# EAGLE schematic Drawing_binary_decimal_converter (EAGLE 9.5.2)
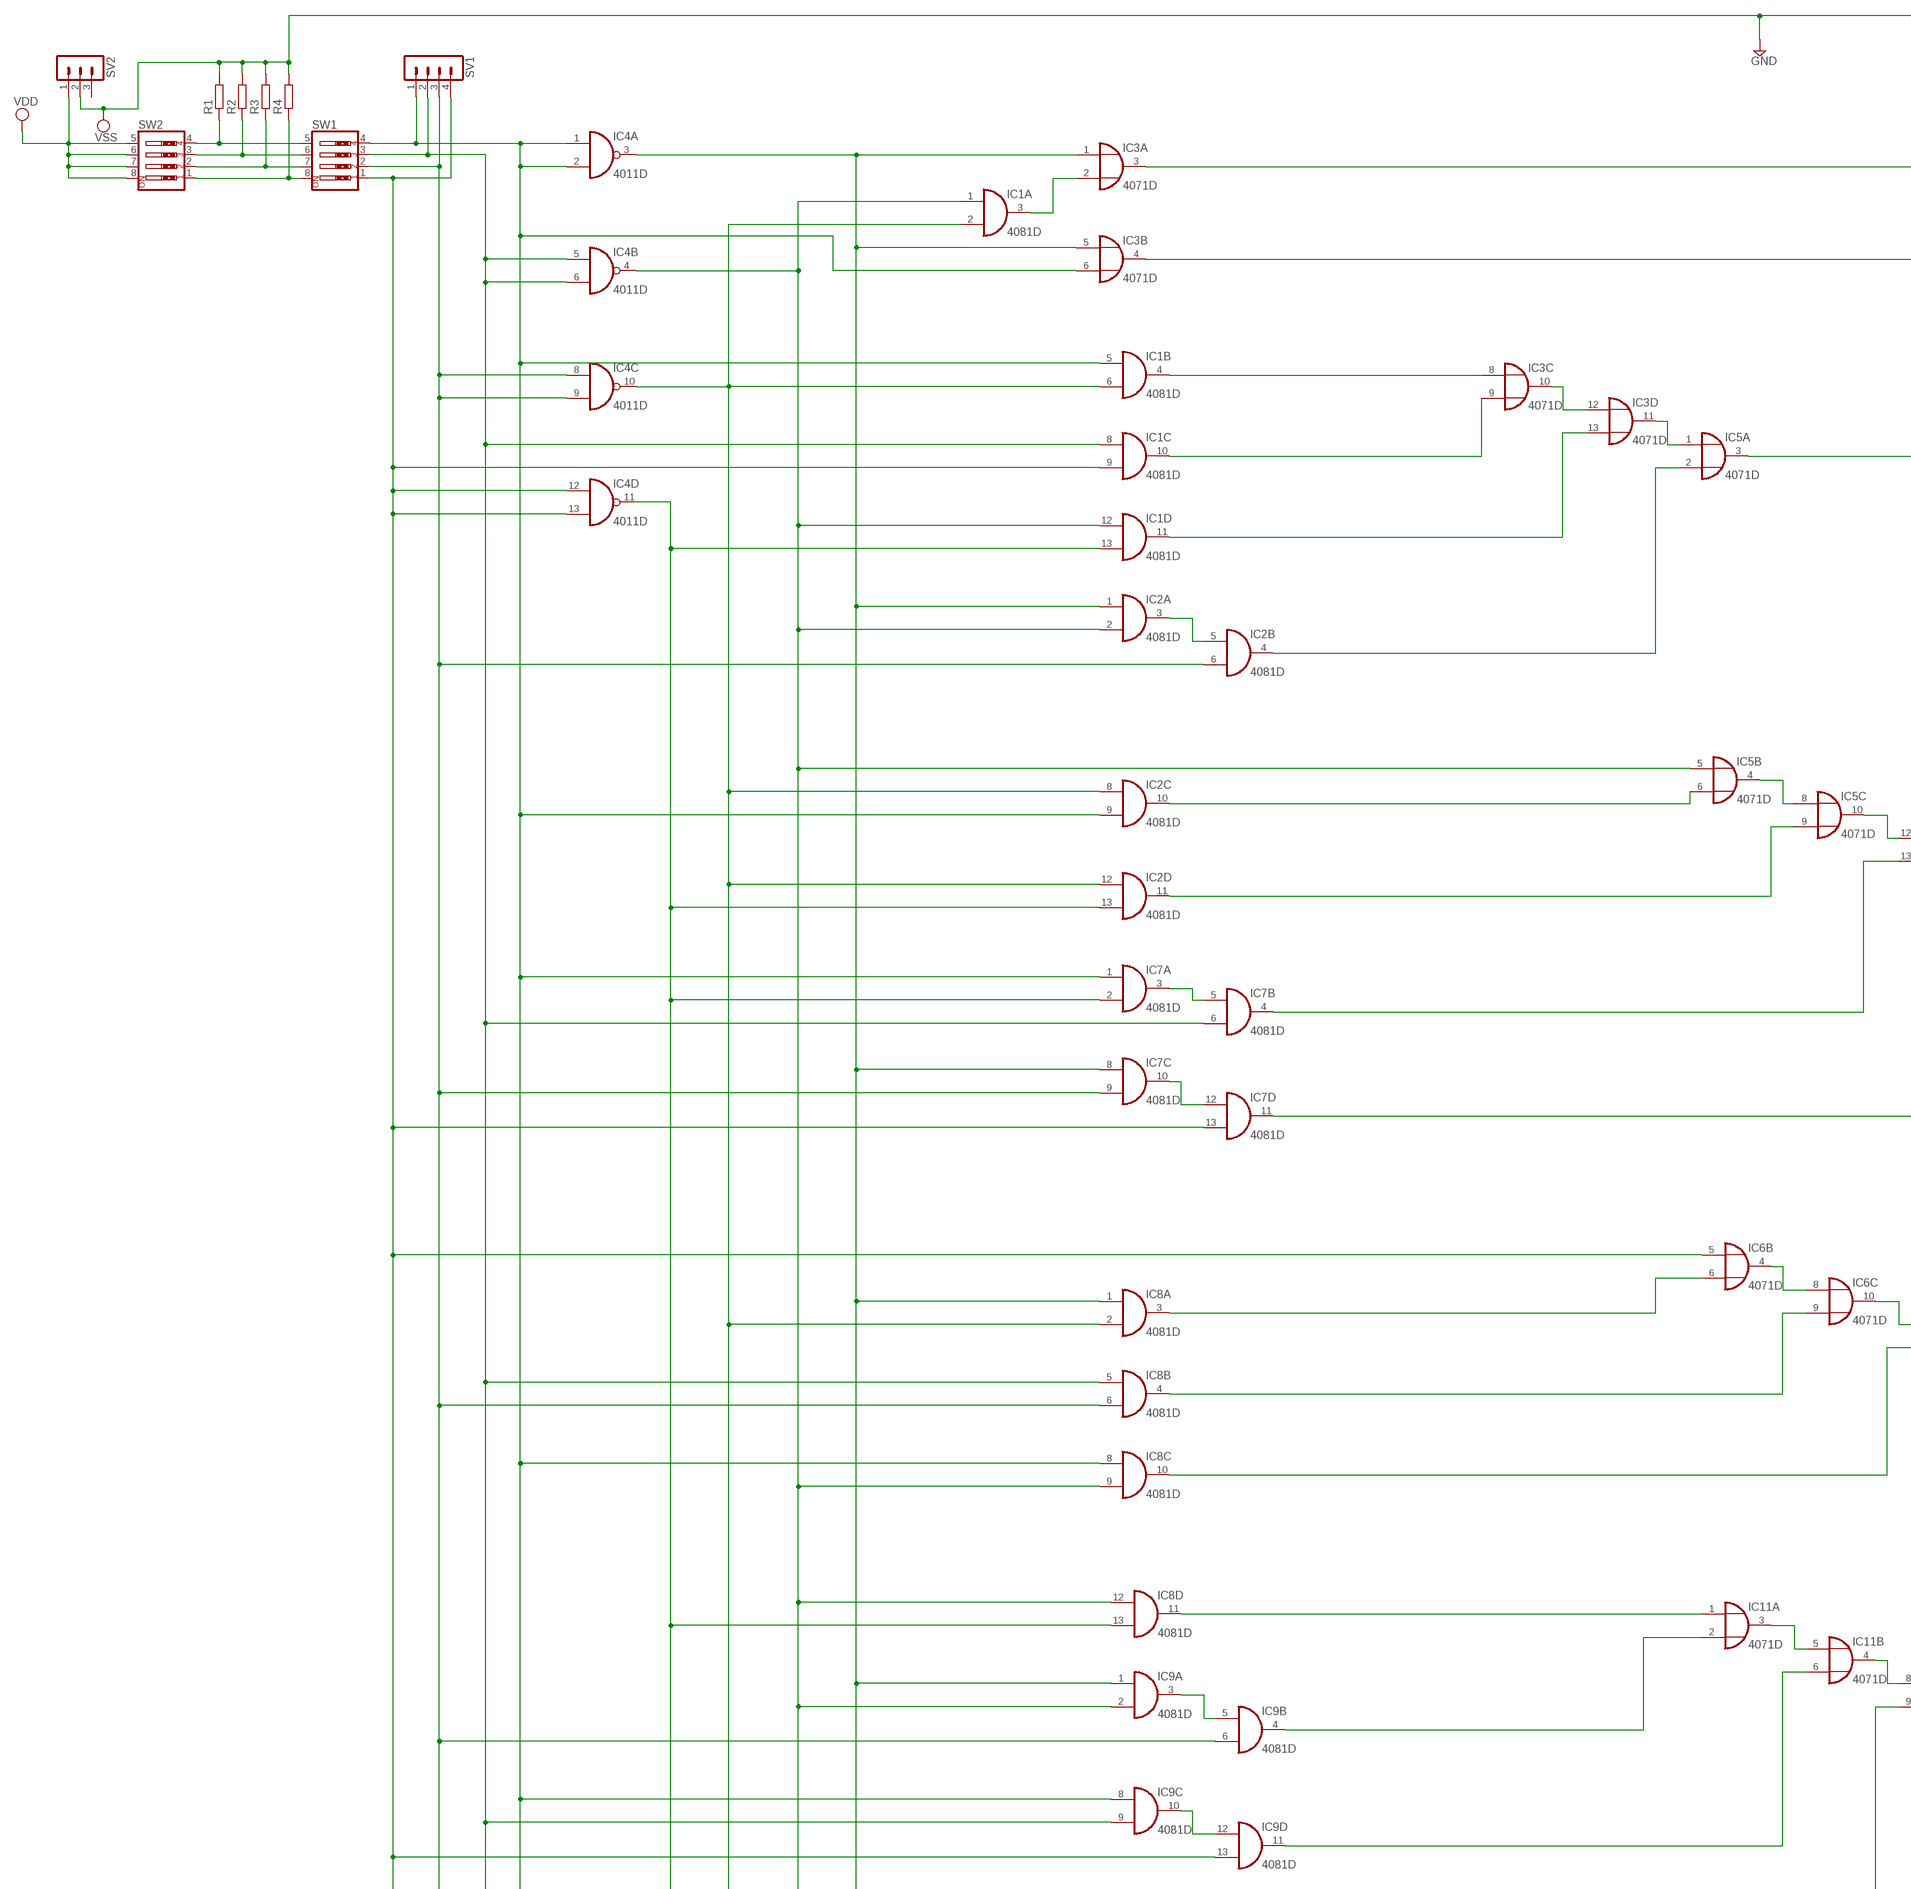
[diagram p0: schematic, sheet 1, part 1 of 3]
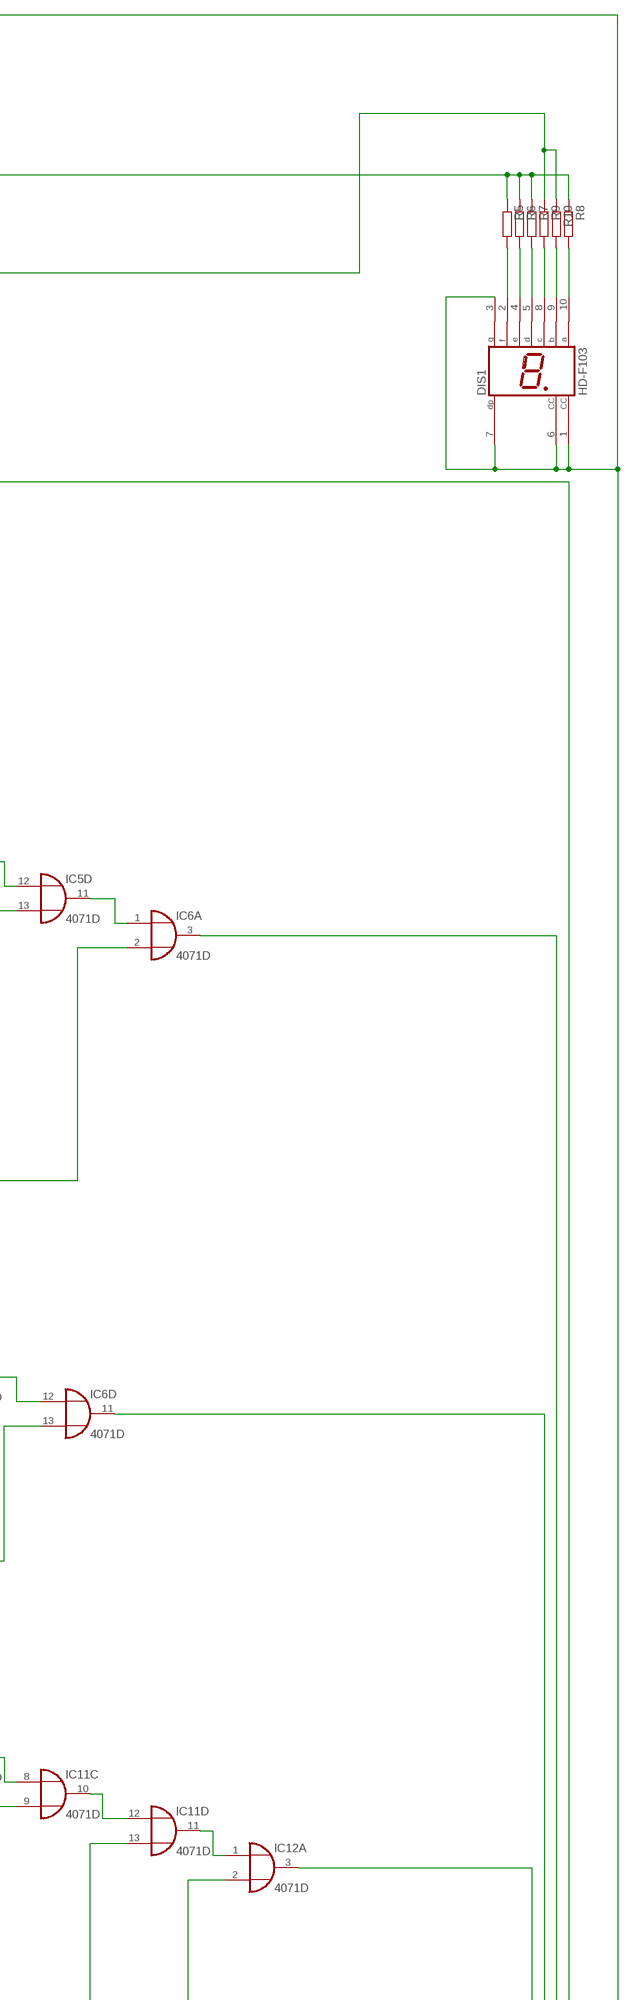
[diagram p1: schematic, sheet 1, part 2 of 3]
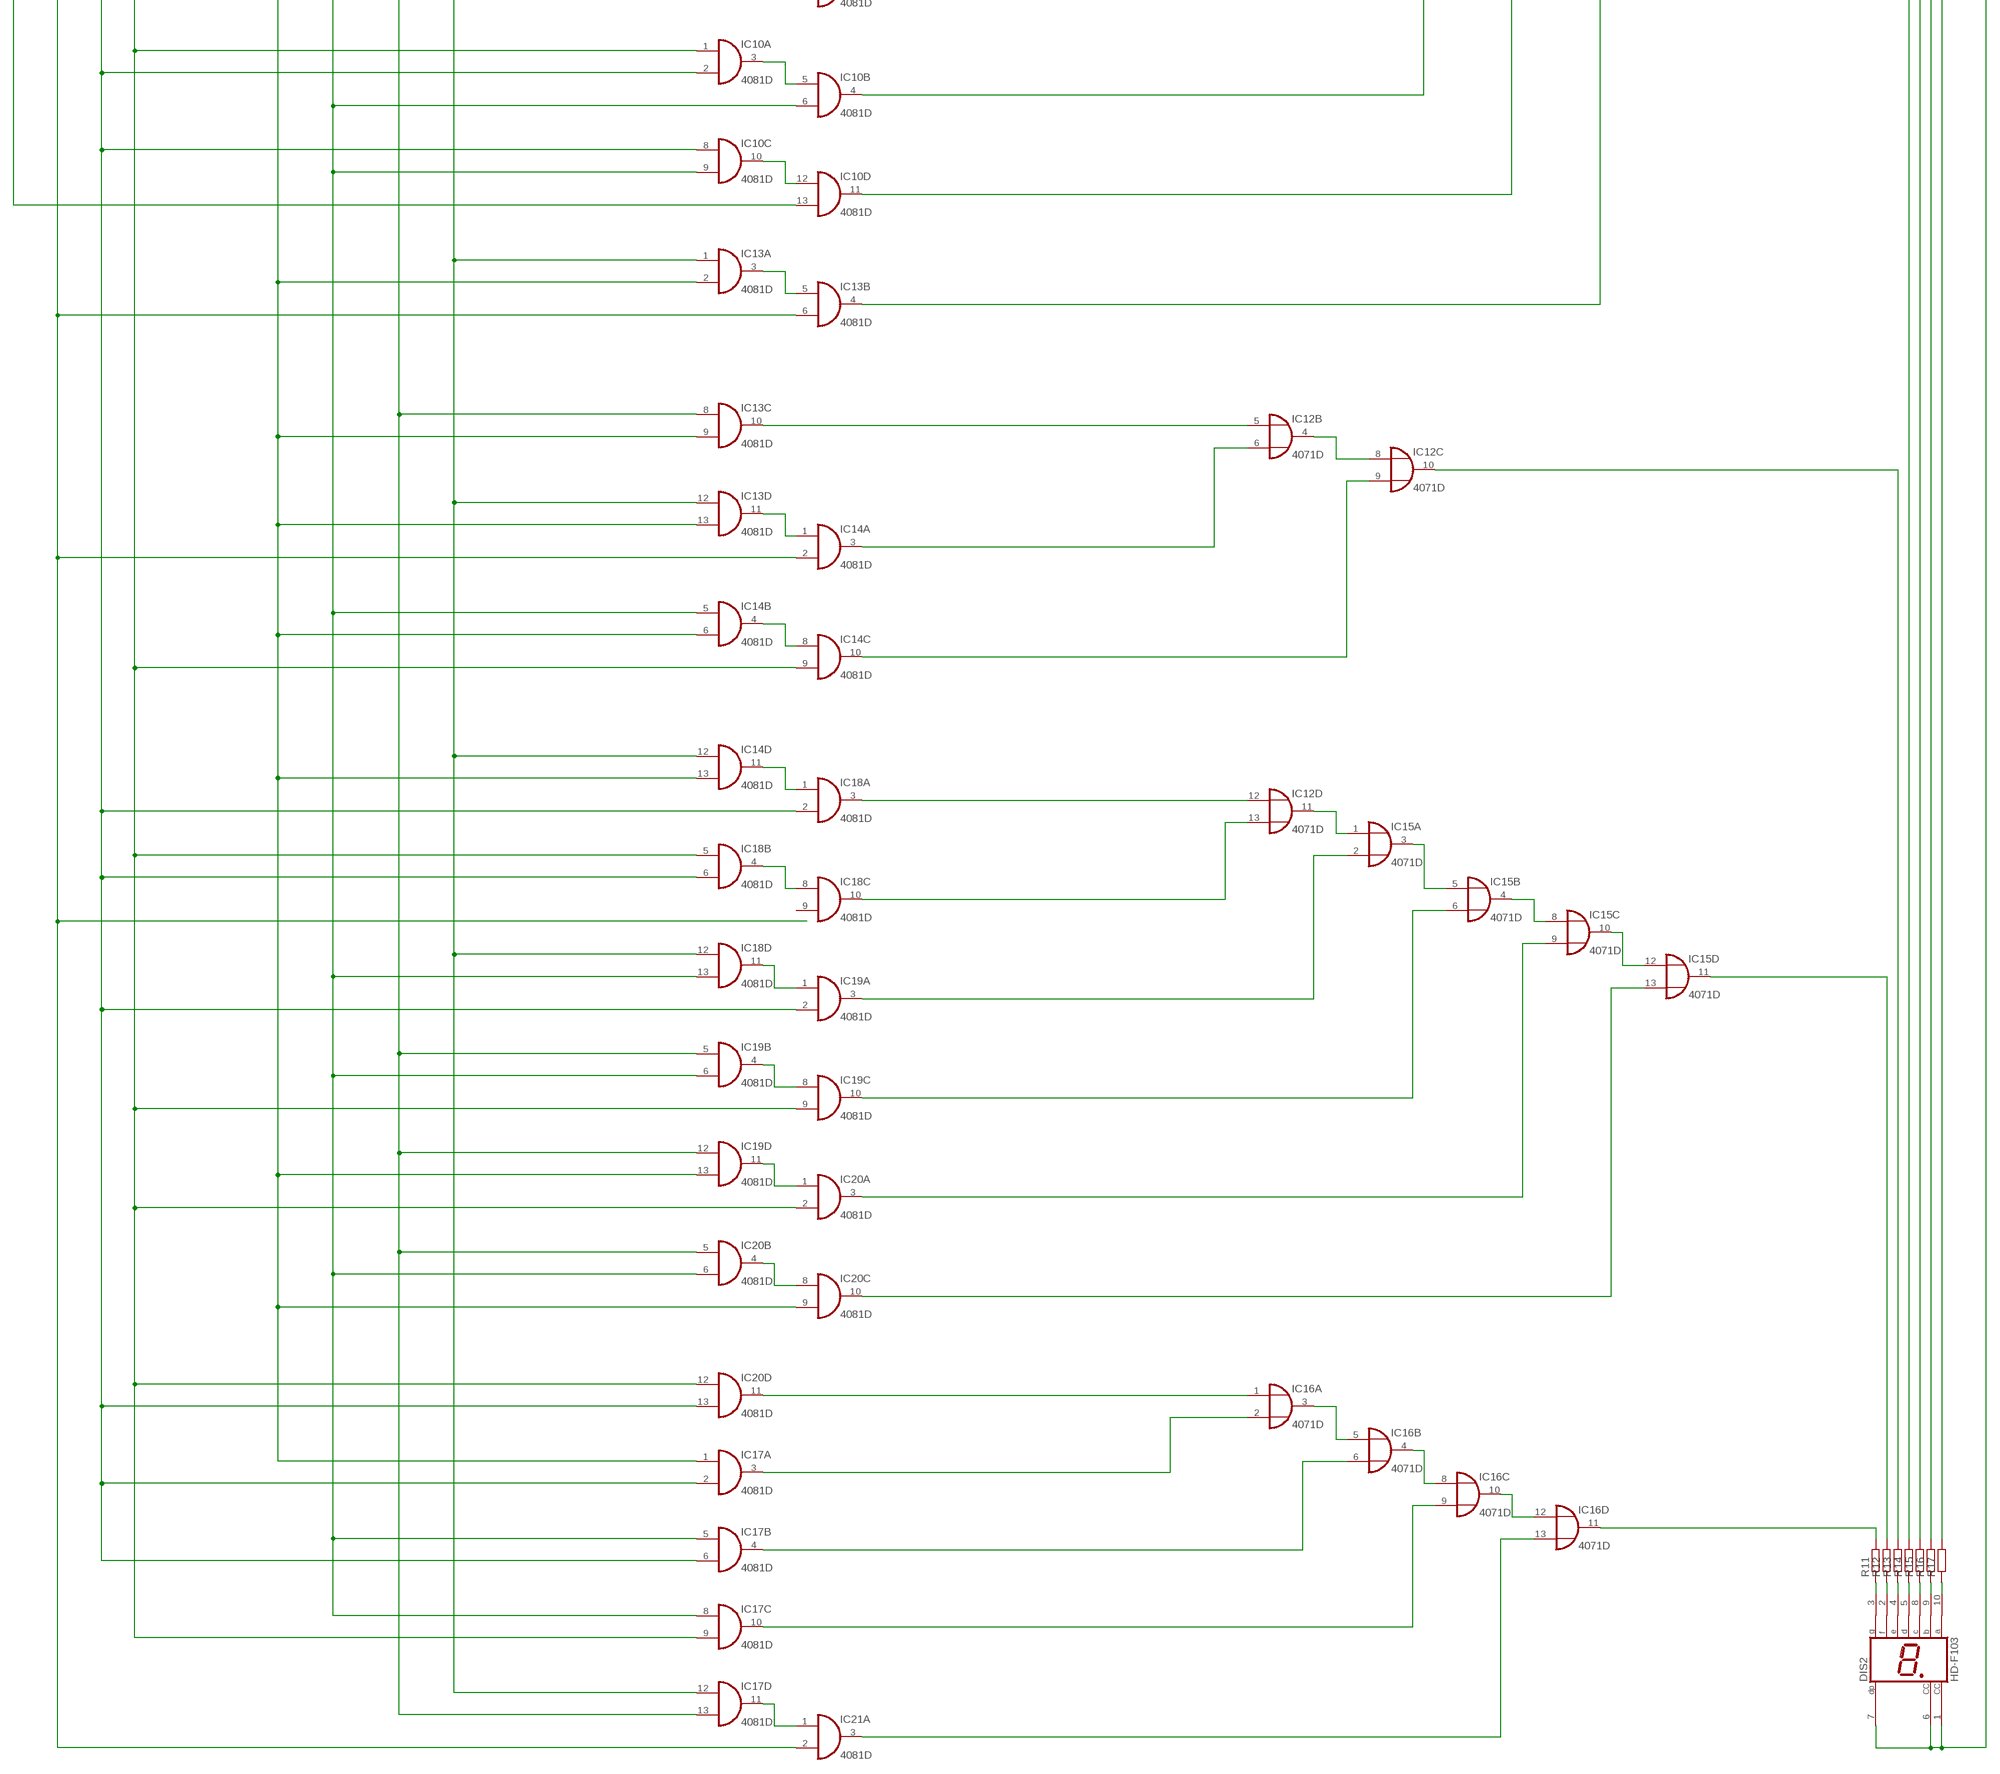
[diagram p2: schematic, sheet 1, part 3 of 3]

## Parts
DIS1  HD-F103  [HDSP-E]
DIS2  HD-F103  [HDSP-E]
IC1  4081D  [SO14]
IC2  4081D  [SO14]
IC3  4071D  [SO14]
IC4  4011D  [SO14]
IC5  4071D  [SO14]
IC6  4071D  [SO14]
IC7  4081D  [SO14]
IC8  4081D  [SO14]
IC9  4081D  [SO14]
IC10  4081D  [SO14]
IC11  4071D  [SO14]
IC12  4071D  [SO14]
IC13  4081D  [SO14]
IC14  4081D  [SO14]
IC15  4071D  [SO14]
IC16  4071D  [SO14]
IC17  4081D  [SO14]
IC18  4081D  [SO14]
IC19  4081D  [SO14]
IC20  4081D  [SO14]
IC21  4081D  [SO14]
R1  R-EU_R1206  [R1206]
R2  R-EU_R1206  [R1206]
R3  R-EU_R1206  [R1206]
R4  R-EU_R1206  [R1206]
R5  R-EU_R1206  [R1206]
R6  R-EU_R1206  [R1206]
R7  R-EU_R1206  [R1206]
R8  R-EU_R1206  [R1206]
R9  R-EU_R1206  [R1206]
R10  R-EU_R1206  [R1206]
R11  R-EU_R1206  [R1206]
R12  R-EU_R1206  [R1206]
R13  R-EU_R1206  [R1206]
R14  R-EU_R1206  [R1206]
R15  R-EU_R1206  [R1206]
R16  R-EU_R1206  [R1206]
R17  R-EU_R1206  [R1206]
SV1  MA04-1  [MA04-1]
SV2  MA03-1  [MA03-1]
SW1  SW_DIP-4  [EDG-04]
SW2  SW_DIP-4  [EDG-04]

## Nets
N$1: IC1.3(A:O) IC3.2(A:I1)
N$2: IC1.2(A:I1) IC1.6(B:I1) IC2.8(C:I0) IC2.12(D:I0) IC4.10(C:O) IC8.2(A:I1) IC10.6(B:I1) IC10.9(C:I1) IC14.5(B:I0) IC17.5(B:I0) IC17.8(C:I0) IC18.13(D:I1) IC19.6(B:I1) IC20.6(B:I1)
N$3: IC6.4(B:O) IC6.8(C:I0)
N$4: IC1.8(C:I0) IC4.5(B:I0) IC4.6(B:I1) IC7.6(B:I1) IC8.5(B:I0) IC9.9(C:I1) IC10.2(A:I1) IC10.8(C:I0) IC17.2(A:I1) IC17.6(B:I1) IC18.2(A:I1) IC18.6(B:I1) IC19.2(A:I1) IC20.13(D:I1) SV1.2 SW1.3
N$5: IC1.1(A:I0) IC1.12(D:I0) IC2.2(A:I1) IC4.4(B:O) IC5.5(B:I0) IC8.9(C:I1) IC8.12(D:I0) IC9.2(A:I1) IC13.8(C:I0) IC17.13(D:I1) IC19.5(B:I0) IC19.12(D:I0) IC20.5(B:I0)
N$6: IC2.6(B:I1) IC4.8(C:I0) IC4.9(C:I1) IC7.9(C:I1) IC8.6(B:I1) IC9.6(B:I1) IC13.6(B:I1) IC14.2(A:I1) IC21.2(A:I1) SV1.3 SW1.2
N$7: R1.1 SW1.5 SW2.4
N$8: IC3.3(A:O) R5.1 R6.1 R7.1 R8.1
N$9: IC2.1(A:I0) IC3.1(A:I0) IC3.5(B:I0) IC4.3(A:O) IC7.8(C:I0) IC8.1(A:I0) IC9.1(A:I0) IC13.1(A:I0) IC13.12(D:I0) IC14.12(D:I0) IC17.12(D:I0) IC18.12(D:I0)
N$10: IC3.4(B:O) R9.1 R10.1
N$11: IC3.10(C:O) IC3.12(D:I0)
N$12: IC3.11(D:O) IC5.1(A:I0)
N$13: IC5.3(A:O) R17.2
N$14: IC1.4(B:O) IC3.8(C:I0)
N$15: IC1.10(C:O) IC3.9(C:I1)
N$16: IC1.11(D:O) IC3.13(D:I1)
N$17: IC2.3(A:O) IC2.5(B:I0)
N$18: IC2.4(B:O) IC5.2(A:I1)
N$19: IC1.13(D:I1) IC2.13(D:I1) IC4.11(D:O) IC7.2(A:I1) IC8.13(D:I1) IC13.2(A:I1) IC13.9(C:I1) IC13.13(D:I1) IC14.6(B:I1) IC14.13(D:I1) IC17.1(A:I0) IC19.13(D:I1) IC20.9(C:I1)
N$20: IC5.4(B:O) IC5.8(C:I0)
N$21: IC5.10(C:O) IC5.12(D:I0)
N$22: IC5.11(D:O) IC6.1(A:I0)
N$23: IC6.3(A:O) R16.2
N$24: IC1.5(B:I0) IC2.9(C:I1) IC3.6(B:I1) IC4.1(A:I0) IC4.2(A:I1) IC7.1(A:I0) IC8.8(C:I0) IC9.8(C:I0) IC10.1(A:I0) IC14.9(C:I1) IC17.9(C:I1) IC18.5(B:I0) IC19.9(C:I1) IC20.2(A:I1) IC20.12(D:I0) SV1.1 SW1.4
N$25: IC2.10(C:O) IC5.6(B:I1)
N$26: IC2.11(D:O) IC5.9(C:I1)
N$27: IC7.3(A:O) IC7.5(B:I0)
N$28: IC5.13(D:I1) IC7.4(B:O)
N$29: IC7.10(C:O) IC7.12(D:I0)
N$30: IC6.2(A:I1) IC7.11(D:O)
N$31: IC6.10(C:O) IC6.12(D:I0)
N$32: IC6.11(D:O) R15.2
N$33: IC6.6(B:I1) IC8.3(A:O)
N$34: IC6.9(C:I1) IC8.4(B:O)
N$35: IC6.13(D:I1) IC8.10(C:O)
N$36: IC11.3(A:O) IC11.5(B:I0)
N$37: IC11.4(B:O) IC11.8(C:I0)
N$38: IC11.10(C:O) IC11.12(D:I0)
N$39: IC11.11(D:O) IC12.1(A:I0)
N$40: IC12.3(A:O) R14.2
N$41: IC8.11(D:O) IC11.1(A:I0)
N$42: IC9.3(A:O) IC9.5(B:I0)
N$43: IC9.10(C:O) IC9.12(D:I0)
N$44: IC10.3(A:O) IC10.5(B:I0)
N$45: IC10.10(C:O) IC10.12(D:I0)
N$46: IC9.4(B:O) IC11.2(A:I1)
N$47: IC9.11(D:O) IC11.6(B:I1)
N$48: IC10.4(B:O) IC11.9(C:I1)
N$49: IC10.11(D:O) IC11.13(D:I1)
N$50: IC13.3(A:O) IC13.5(B:I0)
N$51: IC12.2(A:I1) IC13.4(B:O)
N$52: IC12.5(B:I0) IC13.10(C:O)
N$53: IC12.4(B:O) IC12.8(C:I0)
N$54: IC12.10(C:O) R13.2
N$55: IC13.11(D:O) IC14.1(A:I0)
N$56: IC14.4(B:O) IC14.8(C:I0)
N$57: IC12.6(B:I1) IC14.3(A:O)
N$58: IC12.9(C:I1) IC14.10(C:O)
N$59: IC12.11(D:O) IC15.1(A:I0)
N$60: IC15.3(A:O) IC15.5(B:I0)
N$61: IC15.4(B:O) IC15.8(C:I0)
N$62: IC15.10(C:O) IC15.12(D:I0)
N$63: IC15.11(D:O) R12.2
N$64: IC12.12(D:I0) IC18.3(A:O)
N$65: IC14.11(D:O) IC18.1(A:I0)
N$66: IC18.4(B:O) IC18.8(C:I0)
N$67: IC12.13(D:I1) IC18.10(C:O)
N$68: IC18.11(D:O) IC19.1(A:I0)
N$69: IC15.2(A:I1) IC19.3(A:O)
N$70: IC19.4(B:O) IC19.8(C:I0)
N$71: IC15.6(B:I1) IC19.10(C:O)
N$72: IC19.11(D:O) IC20.1(A:I0)
N$73: IC15.9(C:I1) IC20.3(A:O)
N$74: IC20.4(B:O) IC20.8(C:I0)
N$75: IC15.13(D:I1) IC20.10(C:O)
N$76: IC16.3(A:O) IC16.5(B:I0)
N$77: IC16.4(B:O) IC16.8(C:I0)
N$78: IC16.10(C:O) IC16.12(D:I0)
N$79: IC16.11(D:O) R11.2
N$80: IC16.1(A:I0) IC20.11(D:O)
N$81: IC17.11(D:O) IC21.1(A:I0)
N$82: IC16.2(A:I1) IC17.3(A:O)
N$83: IC16.6(B:I1) IC17.4(B:O)
N$84: IC16.9(C:I1) IC17.10(C:O)
N$85: IC16.13(D:I1) IC21.3(A:O)
N$86: IC1.9(C:I1) IC4.12(D:I0) IC4.13(D:I1) IC6.5(B:I0) IC7.13(D:I1) IC9.13(D:I1) IC10.13(D:I1) SV1.4 SW1.1
N$87: R2.1 SW1.6 SW2.3
N$88: R3.1 SW1.7 SW2.2
N$89: R4.1 SW1.8 SW2.1
N$91: DIS1.8(C) R9.2
N$93: DIS1.2(F) R5.2
N$94: DIS1.4(E) R6.2
N$95: DIS1.10(A) R8.2
N$96: DIS1.5(D) R7.2
N$97: DIS1.9(B) R10.2
N$98: DIS2.3(G) R11.1
N$99: DIS2.2(F) R12.1
N$100: DIS2.4(E) R13.1
N$101: DIS2.5(D) R14.1
N$102: DIS2.8(C) R15.1
N$103: DIS2.9(B) R16.1
N$104: DIS2.10(A) R17.1
VDD: SV2.1 SW2.5 SW2.6 SW2.7 SW2.8
VSS: DIS1.1(CC) DIS1.3(G) DIS1.6(CC) DIS1.7(DP) DIS2.1(CC) DIS2.6(CC) DIS2.7(DP) R1.2 R2.2 R3.2 R4.2 SV2.2 ; supply symbol labelled GND
Unconnected: IC18.9(C:I1) IC21.4(B:O) IC21.5(B:I0) IC21.6(B:I1) IC21.8(C:I0) IC21.9(C:I1) IC21.10(C:O) IC21.11(D:O) IC21.12(D:I0) IC21.13(D:I1) SV2.3

## Power pins joined to a net without a drawn wire
VDD: IC1.14(P:VDD) IC2.14(P:VDD) IC3.14(P:VDD) IC4.14(P:VDD) IC5.14(P:VDD) IC6.14(P:VDD) IC7.14(P:VDD) IC8.14(P:VDD) IC9.14(P:VDD) IC10.14(P:VDD) IC11.14(P:VDD) IC12.14(P:VDD) IC13.14(P:VDD) IC14.14(P:VDD) IC15.14(P:VDD) IC16.14(P:VDD) IC17.14(P:VDD) IC18.14(P:VDD) IC19.14(P:VDD) IC20.14(P:VDD) IC21.14(P:VDD)
VSS: IC1.7(P:VSS) IC2.7(P:VSS) IC3.7(P:VSS) IC4.7(P:VSS) IC5.7(P:VSS) IC6.7(P:VSS) IC7.7(P:VSS) IC8.7(P:VSS) IC9.7(P:VSS) IC10.7(P:VSS) IC11.7(P:VSS) IC12.7(P:VSS) IC13.7(P:VSS) IC14.7(P:VSS) IC15.7(P:VSS) IC16.7(P:VSS) IC17.7(P:VSS) IC18.7(P:VSS) IC19.7(P:VSS) IC20.7(P:VSS) IC21.7(P:VSS)

## Library data of the parts
DIS1 DIS2 = display-hp:HD-F103: LED DISPLAY 1-character 7 segment, decimal point right; OC_FARNELL: unknown; OC_NEWARK: unknown
IC1 IC2 IC7-IC10 IC13 IC14 IC17-IC21 = 40xx:4081: Quad 2-input AND
IC3 IC5 IC6 IC11 IC12 IC15 IC16 = 40xx:4071: Quad 2-input OR
IC4 = 40xx:4011: Quad 2-input NAND
R1-R17 = rcl:R-EU_: RESISTOR, European symbol; SPICEPREFIX: R
SV1 = con-lstb:MA04-1: PIN HEADER; OC_FARNELL: unknown; OC_NEWARK: unknown
SV2 = con-lstb:MA03-1: PIN HEADER; OC_FARNELL: unknown; OC_NEWARK: unknown
SW1 SW2 = special:SW_DIP-4: DIP SWITCH